# Altium project PN-Power.PrjPcb
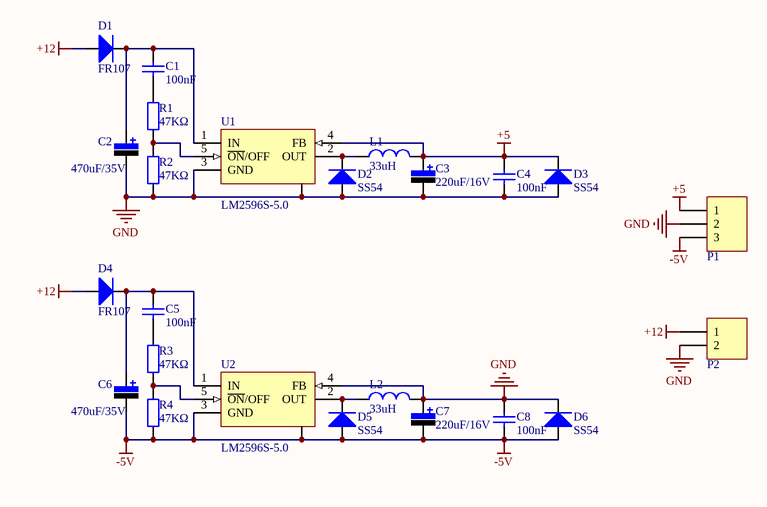
[diagram p0: PN-Power.SchDoc]
1 sheet, 24 parts. Net scope: global (net labels, ports and power ports of the same name join across sheets).
Board file: PN-Power.PcbDoc

## Sheet PN-Power.SchDoc: IPMC Driver
size A4; DrawnBy: YYH; Revision: 1.0; PageSetup: Record=PageOptions|CenterHorizontal=True|CenterVertical=True|PrintScale=0.52|XCorrection=1.00|YCorrection=1.00|PrintKind=0|BorderSize=5000000|LeftOffset=0|BottomOffset=0|Orientation=2|PaperLength=1000|PaperWidth=1000|Scale=100|PaperSource=7|PrintQuality=-3|MediaType=1|DitherType=10|PrintScaleMode=1|PaperKind=A4 210 x 297 毫米¦PaperIndex=9

### Parts
C1  100nF  [0805_C]
C2  470uF/35V  [C-RB-S10]
C3  220uF/16V  [C-RB-S6]
C4  100nF  [0805_C]
C5  100nF  [0805_C]
C6  470uF/35V  [C-RB-S10]
C7  220uF/16V  [C-RB-S6]
C8  100nF  [0805_C]
D1  FR107  [DIODE-SMA]
D2  SS54  [DIODE-SMA]
D3  SS54  [DIODE-SMA]
D4  FR107  [DIODE-SMA]
D5  SS54  [DIODE-SMA]
D6  SS54  [DIODE-SMA]
L1  33uH  [L-SMD-12]
L2  33uH  [L-SMD-12]
P1  Header 3  [HDR3X1_A]  (value not drawn)
P2  Header 2  [HDR2X1_A]  (value not drawn)
R1  47KΩ  [0805_R]
R2  47KΩ  [0805_R]
R3  47KΩ  [0805_R]
R4  47KΩ  [0805_R]
U1  LM2596S-5.0  [TO-263-5]
U2  LM2596S-5.0  [TO-263-5]

### Nets
+5: C3.1 C4.2 D3.2(K) L1.2 P1.1 U1.4(FB)
+12: D1.1(A) D4.1(A) P2.1
-5V: C6.2 C7.2 C8.1 D5.1(A) D6.1(A) P1.3 R4.1 U2.3(GND) U2.6
GND: C2.2 C3.2 C4.1 C7.1 C8.2 D2.1(A) D3.1(A) D6.2(K) L2.2 P1.2 P2.2 R2.1 U1.3(GND) U1.6 U2.4(FB)
NetC1_1: C1.1 R1.2
NetC1_2: C1.2 C2.1 D1.2(K) U1.1(IN)
NetC5_1: C5.1 R3.2
NetC5_2: C5.2 C6.1 D4.2(K) U2.1(IN)
NetD2_2: D2.2(K) L1.1 U1.2(OUT)
NetD5_2: D5.2(K) L2.1 U2.2(OUT)
NetR1_1: R1.1 R2.2 U1.5(~{ON}/OFF)
NetR3_1: R3.1 R4.2 U2.5(~{ON}/OFF)

### Notes on the sheet
- Title
- Size:
- Date:
- A4
- Number:
- Time:
- Revision:
- Sheet
- of
- File:

### Library data of the parts
C1 C4 C5 C8 = 0805 100nF(104) 10% 50V: 贴片电容; ComponentLink1Description: 供应商链接; ComponentLink1URL: http://www.szlcsc.com/product/details_50686.html; Package: 0805; Supplier: LC; SuppliersPartNumber: C49678
C2 C3 C6 C7 = Cap Pol: 极性电解电容; Published: 8-Jun-2000; LatestRevisionDate: 17-Jul-2002; LatestRevisionNote: Re-released for DXP Platform.; PackageReference: RB7.6-15; Publisher: Altium Limited
D1-D6 = Diode: 二极管; Published: 8-Jun-2000; LatestRevisionDate: 17-Jul-2002; LatestRevisionNote: Re-released for DXP Platform.; PackageDocument: Sep-1996; PackageReference: SMC; Publisher: Altium Limited; Code_JEDEC: DO-214-AB
L1 L2 = Inductor: 电感; Code_IEC: 1005; Published: 8-Jun-2000; LatestRevisionDate: 17-Jul-2002; LatestRevisionNote: Re-released for DXP Platform.; PackageReference: 0402-A; Publisher: Altium Limited; Code_JEITA: 0402
P1 = Header 3: 接插件; LatestRevisionDate: 17-Jul-2002; LatestRevisionNote: Re-released for DXP Platform.; Publisher: Altium Limited
P2 = Header 2: 接插件; LatestRevisionDate: 17-Jul-2002; LatestRevisionNote: Re-released for DXP Platform.; Publisher: Altium Limited
R1-R4 = 0805 47KΩ (4702) 1%: 贴片电阻; ComponentLink1Description: 供应商链接; ComponentLink1URL: http://www.szlcsc.com/product/details_18401.html; Package: 0805; Supplier: LC; SuppliersPartNumber: C17713
U1 U2 = LM2596S-5.0: 5V稳压芯片; Note: Tab is connected to GND; Published: 15-Apr-2002; DatasheetVersion: Dec-1997; PackageReference: TS5B; Publisher: Altium Limited; PackageDescription: D2-PAK; 5 Leads; Body 14.4 (inc. leads) x 10.4 mm (LxW max); ComponentLink1Description: Manufacturer Link; ComponentLink1URL: http://www.national.com/; ComponentLink2Description: Datasheet; ComponentLink2URL: http://www.national.com/ds.cgi/LM/LM2596.pdf; ComponentLink3Description: URL Link1; ComponentLink3URL: http://www.national.com/pf/LM/LM2596.html